# Altium schematic sheet LED Driver.SchDoc
size 165 x 165 mm; Author: Chris Cheung
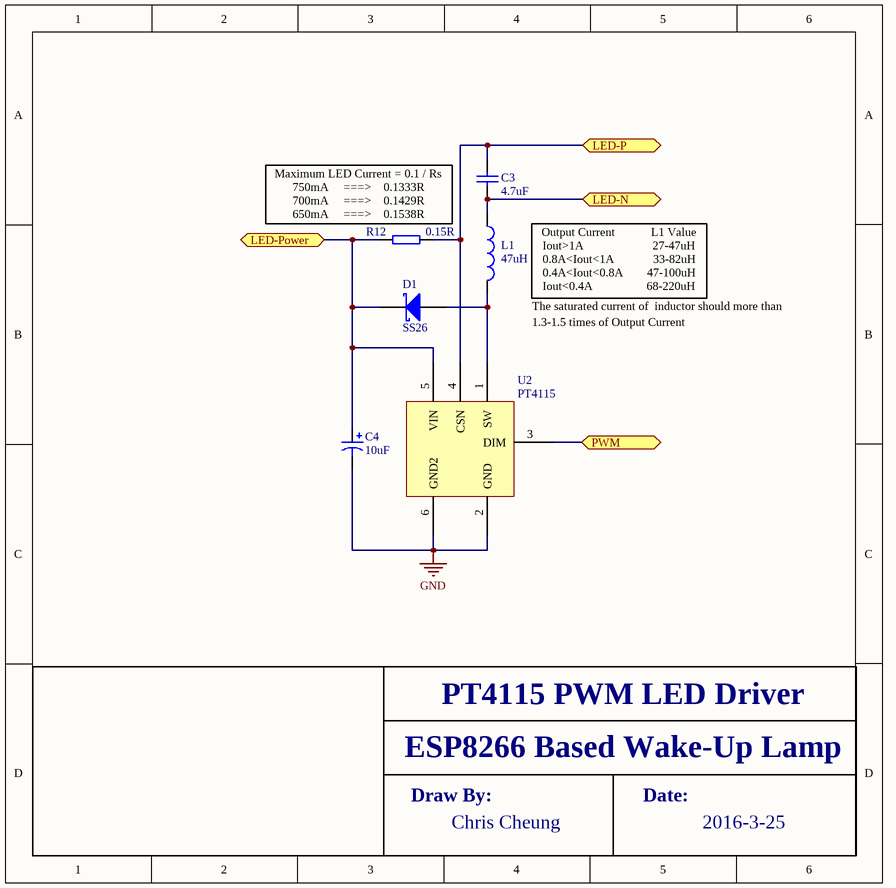
[diagram p0: LED Driver.SchDoc]

## Parts
C3  value 4.7uF  [RAD-0.3]  (hidden comment: Cap)
C4  value 10uF  [C0805]  (hidden comment: Cap Pol3)
D1  SS26  [DO-204AL]
L1  value 47uH  [0402-A]  (hidden comment: Inductor)
R12  0.15R  [SMT_R_0402]
U2  PT4115

## Ports
LED-N, LED-P, LED-Power, PWM

## Nets
GND: C4.2 U2.2(GND) U2.6(GND2)
LED-N: C3.1 L1.1 ; port LED-N
LED-P: C3.2 R12.2 U2.4(CSN) ; port LED-P
LED-Power: C4.1 D1.2(K) R12.1 U2.5(VIN) ; port LED-Power
PWM: U2.3(DIM) ; port PWM
NetD1_1: D1.1(A) L1.2 U2.1(SW)

## Notes on the sheet
- (near R12) Maximum LED Current = 0.1 / Rs
  750mA     ===>    0.1333R
  700mA     ===>    0.1429R
  650mA     ===>    0.1538R
- Output Current            L1 Value
  Iout>1A                       27-47uH
  0.8A<Iout<1A             33-82uH
  0.4A<Iout<0.8A        47-100uH
  Iout<0.4A                  68-220uH
- (near L1) The saturated current of  inductor should more than
- 1.3-1.5 times of Output Current
- PT4115 PWM LED Driver
- ESP8266 Based Wake-Up Lamp
- Draw By:
- Chris Cheung
- Date:
- 2016-3-25

## Library data of the parts
C3 = Cap: Capacitor; Published: 8-Jun-2000; LatestRevisionDate: 17-Jul-2002; LatestRevisionNote: Re-released for DXP Platform.; PackageReference: RAD-0.3; Publisher: Altium Limited; PackageDescription: Radial Cap, Thru-Hole; 2 Leads; 0.3 in Pin Spacing
C4 = Cap Pol3: Polarized Capacitor (Surface Mount); Published: 8-Jun-2000; LatestRevisionDate: 29-May-2009; LatestRevisionNote: IPC-7351 Footprint Added.; PackageReference: C0805; Publisher: Altium Limited; PackageDescription: Chip Capacitor
D1 = Diode 11DQ03: Schottky Rectifier; Published: 8-Jun-2000; LatestRevisionDate: 17-Jul-2002; LatestRevisionNote: Re-released for DXP Platform.; DatasheetVersion: Dec-1997; PackageReference: DO-204AL; Publisher: Altium Limited; PackageDescription: Diode, Axial; Body 5.2 x 2.7 mm (LxDia. max), Lead Dia. 0.86 mm (max); Code_JEDEC: DO-204-AL; ComponentLink1Description: Manufacturer Link; ComponentLink1URL: http://www.irf.com/; ComponentLink2Description: Datasheet; ComponentLink2URL: http://www.irf.com/product-info/datasheets/data/11dq03.pdf
L1 = Inductor: Code_IEC: 1005; Published: 8-Jun-2000; LatestRevisionDate: 29-May-2009; LatestRevisionNote: IPC-7351 Footprint Added.; PackageReference: 0402-A; Publisher: Altium Limited; PackageDescription: Chip Inductor; Code_JEITA: 0402
R12 = SMT_R_0402: Surface mount resistor 0402
U2 = PT4115: LED Driver